# Altium schematic sheet Sheet2.SchDoc
size A3
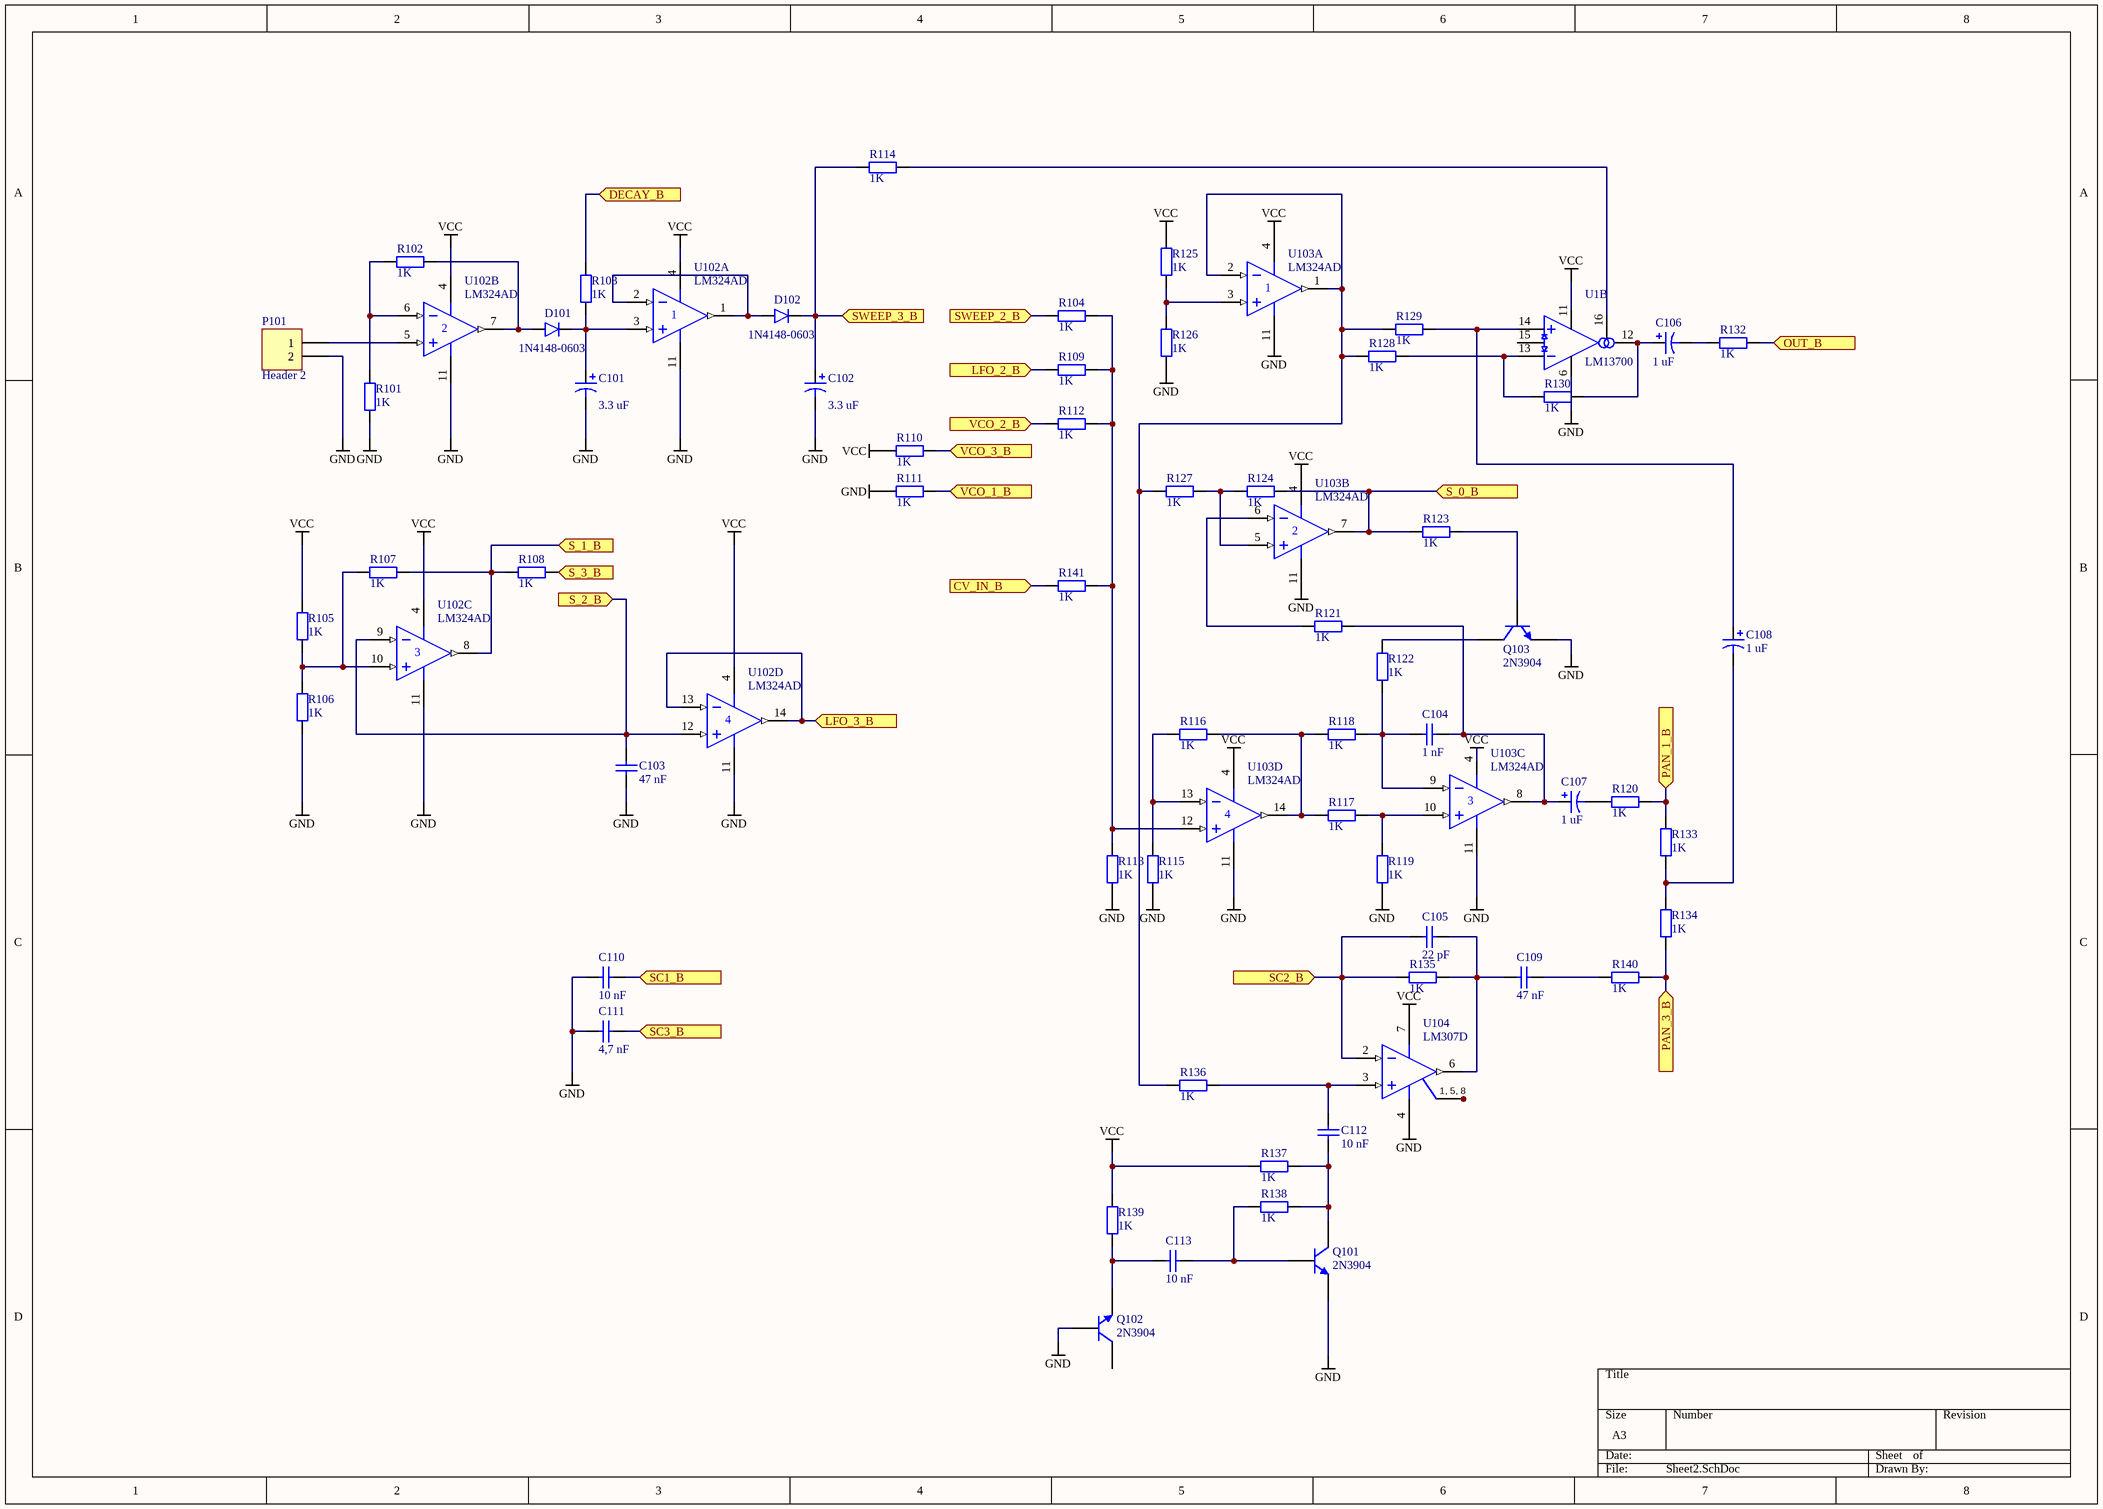
[diagram p0: Sheet2.SchDoc]

## Parts
C101  value 3.3 uF  [C1206]  (hidden comment: Cap Pol1)
C102  value 3.3 uF  [C1206]  (hidden comment: Cap Pol1)
C103  value 47 nF  [C1206]  (hidden comment: Cap)
C104  value 1 nF  [C1206]  (hidden comment: Cap)
C105  value 22 pF  [C1206]  (hidden comment: Cap)
C106  value 1 uF  [C1206]  (hidden comment: Cap Pol1)
C107  value 1 uF  [C1206]  (hidden comment: Cap Pol1)
C108  value 1 uF  [C1206]  (hidden comment: Cap Pol1)
C109  value 47 nF  [C1206]  (hidden comment: Cap)
C110  value 10 nF  [C1206]  (hidden comment: Cap)
C111  value 4,7 nF  [C1206]  (hidden comment: Cap)
C112  value 10 nF  [C1206]  (hidden comment: Cap)
C113  value 10 nF  [C1206]  (hidden comment: Cap)
D101  1N4148-0603  [D0603]
D102  1N4148-0603  [D0603]
P101  Header 2  [HDR1X2]
Q101  2N3904  [TO-92A]
Q102  2N3904  [TO-92A]
Q103  2N3904  [TO-92A]
R101  value 1K  [R1206]  (hidden comment: Res2)
R102  value 1K  [R1206]  (hidden comment: Res2)
R103  value 1K  [R1206]  (hidden comment: Res2)
R104  value 1K  [R1206]  (hidden comment: Res2)
R105  value 1K  [R1206]  (hidden comment: Res2)
R106  value 1K  [R1206]  (hidden comment: Res2)
R107  value 1K  [R1206]  (hidden comment: Res2)
R108  value 1K  [R1206]  (hidden comment: Res2)
R109  value 1K  [R1206]  (hidden comment: Res2)
R110  value 1K  [R1206]  (hidden comment: Res2)
R111  value 1K  [R1206]  (hidden comment: Res2)
R112  value 1K  [R1206]  (hidden comment: Res2)
R113  value 1K  [R1206]  (hidden comment: Res2)
R114  value 1K  [R1206]  (hidden comment: Res2)
R115  value 1K  [R1206]  (hidden comment: Res2)
R116  value 1K  [R1206]  (hidden comment: Res2)
R117  value 1K  [R1206]  (hidden comment: Res2)
R118  value 1K  [R1206]  (hidden comment: Res2)
R119  value 1K  [R1206]  (hidden comment: Res2)
R120  value 1K  [R1206]  (hidden comment: Res2)
R121  value 1K  [R1206]  (hidden comment: Res2)
R122  value 1K  [R1206]  (hidden comment: Res2)
R123  value 1K  [R1206]  (hidden comment: Res2)
R124  value 1K  [R1206]  (hidden comment: Res2)
R125  value 1K  [R1206]  (hidden comment: Res2)
R126  value 1K  [R1206]  (hidden comment: Res2)
R127  value 1K  [R1206]  (hidden comment: Res2)
R128  value 1K  [R1206]  (hidden comment: Res2)
R129  value 1K  [R1206]  (hidden comment: Res2)
R130  value 1K  [R1206]  (hidden comment: Res2)
R132  value 1K  [R1206]  (hidden comment: Res2)
R133  value 1K  [R1206]  (hidden comment: Res2)
R134  value 1K  [R1206]  (hidden comment: Res2)
R135  value 1K  [R1206]  (hidden comment: Res2)
R136  value 1K  [R1206]  (hidden comment: Res2)
R137  value 1K  [R1206]  (hidden comment: Res2)
R138  value 1K  [R1206]  (hidden comment: Res2)
R139  value 1K  [R1206]  (hidden comment: Res2)
R140  value 1K  [R1206]  (hidden comment: Res2)
R141  value 1K  [R1206]  (hidden comment: Res2)
U1  LM13700  [SOIC16]  (part B of 2)
U102  LM324AD  [D014_N]  (parts A,B,C,D of 4)
U103  LM324AD  [D014_N]  (parts A,B,C,D of 4)
U104  LM307D  [D008_L]

## Ports
CV_IN_B, DECAY_B, LFO_2_B, LFO_3_B, OUT_B, PAN_1_B, PAN_3_B, S_0_B, S_1_B, S_2_B, S_3_B, SC1_B, SC2_B, SC3_B, SWEEP_2_B, SWEEP_3_B, VCO_1_B, VCO_2_B, VCO_3_B

## Nets
GND: C101.2 C102.2 C103.1 C110.2 C111.2 P101.2 Q101.1(E) Q102.2(B) Q103.1(E) R101.1 R106.1 R111.2 R113.2 R115.1 R119.2 R126.2 U1.6(V-) U102.11(V-) U103.11(V-) U104.4(V-)
VCC: R105.2 R110.1 R125.1 R137.2 R139.1 U1.11(V+) U102.4(V+) U103.4(V+) U104.7(V+)
CV_IN_B: R141.1 ; port CV_IN_B
DECAY_B: R103.1 ; port DECAY_B
LFO_2_B: R109.2 ; port LFO_2_B
LFO_3_B: U102.13(IN-) U102.14(OUT) ; port LFO_3_B
OUT_B: R132.2 ; port OUT_B
PAN_1_B: R120.2 R133.2 ; port PAN_1_B
PAN_3_B: R134.1 R140.2 ; port PAN_3_B
S_0_B: R123.2 R124.1 U103.7(OUT) ; port S_0_B
S_1_B: R107.1 R108.2 U102.8(OUT) ; port S_1_B
S_2_B: C103.2 U102.9(IN-) U102.12(IN+) ; port S_2_B
S_3_B: R108.1 ; port S_3_B
SC1_B: C110.1 ; port SC1_B
SC2_B: C105.2 R135.2 U104.2(IN-) ; port SC2_B
SC3_B: C111.1 ; port SC3_B
SWEEP_2_B: R104.1 ; port SWEEP_2_B
SWEEP_3_B: C102.1 D102.1 R114.1 ; port SWEEP_3_B
VCO_1_B: R111.1 ; port VCO_1_B
VCO_2_B: R112.2 ; port VCO_2_B
VCO_3_B: R110.2 ; port VCO_3_B
NetC101_1: C101.1 D101.1 R103.2 U102.3(IN+)
NetC104_1: C104.1 C107.1 R121.2 U103.8(OUT)
NetC104_2: C104.2 R118.1 R122.1 U103.9(IN-)
NetC105_1: C105.1 C109.1 R135.1 U104.6(OUT)
NetC106_1: C106.1 R130.2 U1.12(amp_bias)
NetC106_2: C106.2 R132.1
NetC107_2: C107.2 R120.1
NetC108_1: C108.1 R129.2 U1.14(+)
NetC108_2: C108.2 R133.1 R134.2
NetC109_2: C109.2 R140.1
NetC112_1: C112.1 R136.1 U104.3(IN+)
NetC112_2: C112.2 Q101.3(C) R137.1 R138.1
NetC113_1: C113.1 Q102.1(E) R139.2
NetC113_2: C113.2 Q101.2(B) R138.2
NetD101_2: D101.2 R102.1 U102.7(OUT)
NetD102_2: D102.2 U102.1(OUT) U102.2(IN-)
NetP101_1: P101.1 U102.5(IN+)
NetQ103_2: Q103.2(B) R123.1
NetQ103_3: Q103.3(C) R122.2
NetR101_2: R101.2 R102.2 U102.6(IN-)
NetR104_2: R104.2 R109.1 R112.1 R113.1 R141.2 U103.12(IN+)
NetR105_1: R105.1 R106.2 R107.2 U102.10(IN+)
NetR114_2: R114.2 U1.16(amp_bias)
NetR115_2: R115.2 R116.2 U103.13(IN-)
NetR116_1: R116.1 R117.2 R118.2 U103.14(OUT)
NetR117_1: R117.1 R119.1 U103.10(IN+)
NetR121_1: R121.1 U103.6(IN-)
NetR124_2: R124.2 R127.2 U103.5(IN+)
NetR125_2: R125.2 R126.1 U103.3(IN+)
NetR127_1: R127.1 R128.1 R129.1 R136.2 U103.1(OUT) U103.2(IN-)
NetR128_2: R128.2 R130.1 U1.13(amp_bias)
NetU104_1: U104.1(NC) U104.5(NC) U104.8(NC)

Not connected (* = marked no-connect by the designer): Q102 3(C); U1 15(amp_bias)

## Notes on the sheet
- (in symbol LM307D) 1, 5, 8

## Library data of the parts
C101 C102 C106-C108 = Cap Pol1: Polarized Capacitor (Radial); Published: 8-Jun-2000; LatestRevisionDate: 17-Jul-2002; LatestRevisionNote: Re-released for DXP Platform.; PackageReference: RB7.6-15; Publisher: Altium Limited; PackageDescription: Polarized Capacitor (Radial); 2 Leads
C103-C105 C109-C113 = Cap: Capacitor; Published: 8-Jun-2000; LatestRevisionDate: 17-Jul-2002; LatestRevisionNote: Re-released for DXP Platform.; PackageReference: RAD-0.3; Publisher: Altium Limited; PackageDescription: Radial Cap, Thru-Hole; 2 Leads; 0.3 in Pin Spacing
D101 D102 = 1N4148: Dioda: przełączająca; SMD; 100V; 150mA; 4ns; 0603; Manufacture: DC COMPONENTS; Shop1: TME; DafaultFootprint: 0603; Value1: 75V; Parameter1: Vr; Parameter2: If; ComponentLink1URL: http://www.tme.eu/pl/Document/56f18f971963fb7c3e40973a6fd3d82c/CD4148W_WT.pdf; ComponentLink2URL: *; ComponentLink1Description: Datasheet; ComponentLink2Description: *; Tolerance1: *; Shop1ID: *; ComponentType: Diod Rectifier; Assembly: SMD; Replacement: *; ComponentSymbol: 1N4148-0603; Value2: 150mA
P101 = Header 2: Header, 2-Pin; LatestRevisionDate: 17-Jul-2002; LatestRevisionNote: Re-released for DXP Platform.; Publisher: Altium Limited
Q101-Q103 = 2N3904: NPN General Purpose Amplifier; Published: 8-Jun-2000; LatestRevisionDate: 15-Jan-2003; LatestRevisionNote: PCB Footprint 'BCY-W3/D4.7' replaced; DatasheetVersion: 1997; PackageVersion: Sep-1998; PackageReference: TO-92A; Publisher: Altium Limited; PackageDescription: TO, Flat Index; 3 In-Line, Axial Leads; Body Dia. 4.5mm; Leads 0.51 x 0.48 mm (max); ComponentLink1Description: Manufacturer Link; ComponentLink1URL: http://www.fairchildsemi.com/; ComponentLink2Description: Datasheet; ComponentLink2URL: http://www.fairchildsemi.com/ds/2N%2F2N3904.pdf
R101-R130 R132-R141 = Res2: Resistor; Published: 8-Jun-2000; LatestRevisionDate: 17-Jul-2002; LatestRevisionNote: Re-released for DXP Platform.; PackageReference: AXIAL-0.4; Publisher: Altium Limited; PackageDescription: Axial Device, Thru-Hole; 2 Leads; 0.4 in Pin Spacing
U102 U103 = LM324AD: Quadruple Operational Amplifier; Published: 15-Apr-2002; LatestRevisionDate: 13-Apr-2006; LatestRevisionNote: IPC-7351 Footprint Added.; DatasheetVersion: Jan-1989; PackageVersion: Jan-1998; PackageReference: D014; Publisher: Altium Limited; PackageDescription: 14-Pin Small Outline Integrated Circuit 1.27 mm Pitch; Code_IPC: SOIC127P600-14; ComponentLink1Description: Manufacturer Link; ComponentLink1URL: http://www.ti.com/; ComponentLink2Description: Datasheet; ComponentLink2URL: http://www-s.ti.com/sc/ds/lm324.pdf
U104 = LM307D: High-Performance Operational Amplifier; Published: 15-Apr-2002; LatestRevisionDate: 13-Apr-2006; LatestRevisionNote: IPC-7351 Footprint Added.; DatasheetVersion: Jun-1988; PackageVersion: Jan-1998; PackageReference: D008; Publisher: Altium Limited; PackageDescription: 8-Pin Small Outline Integrated Circuit 1.27 mm Pitch; Code_IPC: SOIC127P600-8; ComponentLink1Description: Manufacturer Link; ComponentLink1URL: http://www.ti.com/; ComponentLink2Description: Datasheet; ComponentLink2URL: http://www-s.ti.com/sc/ds/lm307.pdf